# EAGLE design Nano_PCB (EAGLE 9.6.2)
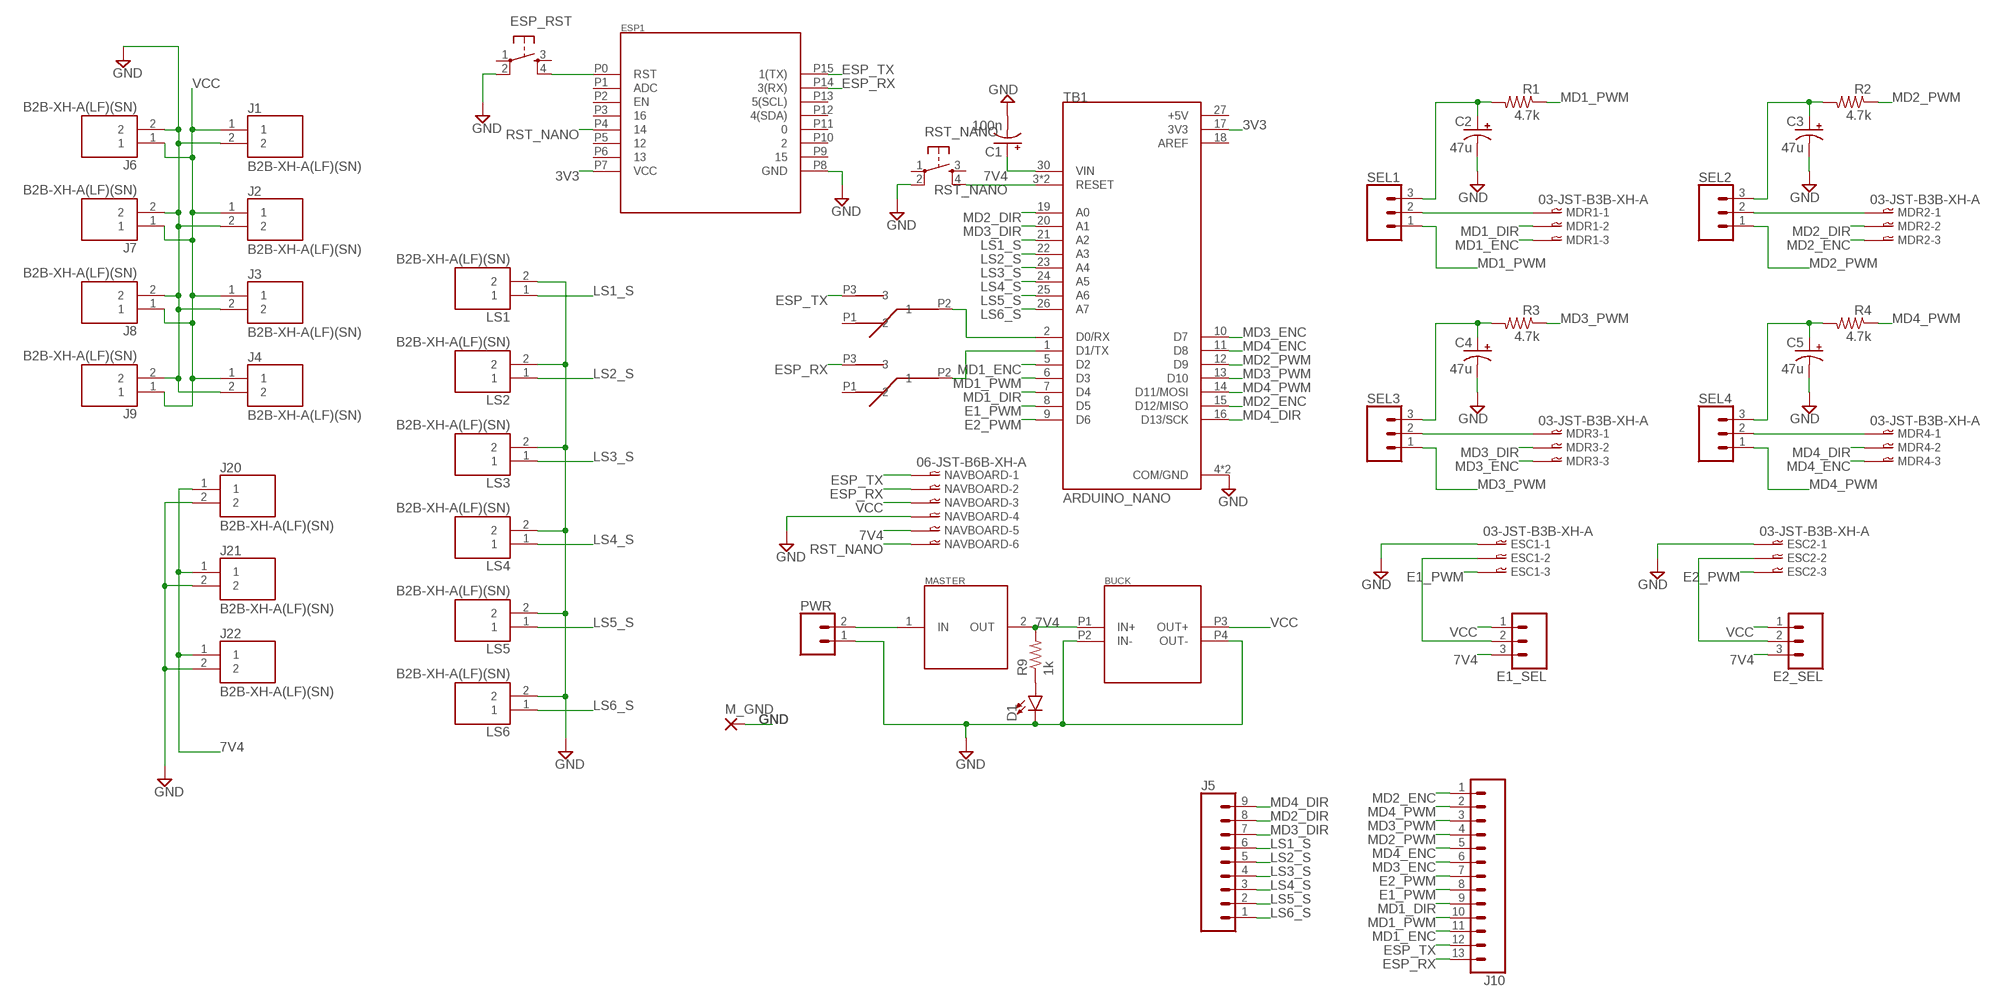
[diagram p0: schematic, sheet 1]

## Parts
BUCK  5V_BUCK  [5V_BUCK]
C1  100n  CPOL-USTT2D6  [TT2D6]
C2  47u  CPOL-USE2-5  [E2-5]
C3  47u  CPOL-USE2-5  [E2-5]
C4  47u  CPOL-USE2-5  [E2-5]
C5  47u  CPOL-USE2-5  [E2-5]
D1  LED3MM  [LED_3MM]
E1_SEL  CONN_03  [1X03]
E2_SEL  CONN_03  [1X03]
ESC1  03-JST-B3B-XH-A  [B3B-XH]
ESC2  03-JST-B3B-XH-A  [B3B-XH]
ESP1  ESP07  [ESP07]
ESP_RST  TAC_SWITCHPTH  [TACTILE-PTH]
J1  B2B-XH-A(LF)(SN)  [JST_B2B-XH-A(LF)(SN)]
J2  B2B-XH-A(LF)(SN)  [JST_B2B-XH-A(LF)(SN)]
J3  B2B-XH-A(LF)(SN)  [JST_B2B-XH-A(LF)(SN)]
J4  B2B-XH-A(LF)(SN)  [JST_B2B-XH-A(LF)(SN)]
J5  CONN_09  [1X09]
J6  B2B-XH-A(LF)(SN)  [JST_B2B-XH-A(LF)(SN)]
J7  B2B-XH-A(LF)(SN)  [JST_B2B-XH-A(LF)(SN)]
J8  B2B-XH-A(LF)(SN)  [JST_B2B-XH-A(LF)(SN)]
J9  B2B-XH-A(LF)(SN)  [JST_B2B-XH-A(LF)(SN)]
J10  CONN_13  [1X13]
J20  B2B-XH-A(LF)(SN)  [JST_B2B-XH-A(LF)(SN)]
J21  B2B-XH-A(LF)(SN)  [JST_B2B-XH-A(LF)(SN)]
J22  B2B-XH-A(LF)(SN)  [JST_B2B-XH-A(LF)(SN)]
LS1  B2B-XH-A(LF)(SN)  [JST_B2B-XH-A(LF)(SN)]
LS2  B2B-XH-A(LF)(SN)  [JST_B2B-XH-A(LF)(SN)]
LS3  B2B-XH-A(LF)(SN)  [JST_B2B-XH-A(LF)(SN)]
LS4  B2B-XH-A(LF)(SN)  [JST_B2B-XH-A(LF)(SN)]
LS5  B2B-XH-A(LF)(SN)  [JST_B2B-XH-A(LF)(SN)]
LS6  B2B-XH-A(LF)(SN)  [JST_B2B-XH-A(LF)(SN)]
M_GND  WIREPADSMD5-2,5  [5-2,5]
MASTER  MED_SWITCH  [MED_SWITCH]
MDR1  03-JST-B3B-XH-A  [B3B-XH]
MDR2  03-JST-B3B-XH-A  [B3B-XH]
MDR3  03-JST-B3B-XH-A  [B3B-XH]
MDR4  03-JST-B3B-XH-A  [B3B-XH]
NAVBOARD  06-JST-B6B-XH-A  [B6B-XH]
PWR  CONN_02PTH4  [1X02_XTRA_BIG]
R1  4.7k  R-US_0204/7  [0204/7]
R2  4.7k  R-US_0204/7  [0204/7]
R3  4.7k  R-US_0204/7  [0204/7]
R4  4.7k  R-US_0204/7  [0204/7]
R9  1k  R-US_0204/7  [0204/7]
RST_NANO  TAC_SWITCHPTH  [TACTILE-PTH]
SEL1  CONN_03  [1X03]
SEL2  CONN_03  [1X03]
SEL3  CONN_03  [1X03]
SEL4  CONN_03  [1X03]
TB1  ARDUINO_NANO  [SHIELD_ARDUINO_NANO]
U$1  SLIDE_SWITCH  [SLIDE_SWITCH]
U$2  SLIDE_SWITCH  [SLIDE_SWITCH]

## Nets
3V3: ESP1.P7(VCC) TB1.17(3V3)
7V4: BUCK.P1(IN+) C1.+ E1_SEL.3 E2_SEL.3 J20.1 J21.1 J22.1 MASTER.2(OUT) NAVBOARD.P$5 R9.2 TB1.30(VIN)
E1_PWM: ESC1.P$3 J10.8 TB1.8(D5)
E2_PWM: ESC2.P$3 J10.7 TB1.9(D6)
ESP_RX: ESP1.P14(3(RX)) J10.13 NAVBOARD.P$2 U$2.P3
ESP_TX: ESP1.P15(1(TX)) J10.12 NAVBOARD.P$1 U$1.P3
GND: BUCK.P2(IN-) BUCK.P4(OUT-) C1.- C2.- C3.- C4.- C5.- D1.K(C) ESC1.P$1 ESC2.P$1 ESP1.P8(GND) ESP_RST.2 J1.2 J2.2 J3.2 J4.2 J6.2 J7.2 J8.2 J9.2 J20.2 J21.2 J22.2 LS1.2 LS2.2 LS3.2 LS4.2 LS5.2 LS6.2 M_GND.1(P) NAVBOARD.P$4 PWR.1 RST_NANO.2 TB1.4(COM/GND) TB1.29(COM/GND)
LS1_S: J5.6 LS1.1 TB1.21(A2)
LS2_S: J5.5 LS2.1 TB1.22(A3)
LS3_S: J5.4 LS3.1 TB1.23(A4)
LS4_S: J5.3 LS4.1 TB1.24(A5)
LS5_S: J5.2 LS5.1 TB1.25(A6)
LS6_S: J5.1 LS6.1 TB1.26(A7)
MD1_DIR: J10.9 MDR1.P$2 TB1.7(D4)
MD1_ENC: J10.11 MDR1.P$3 TB1.5(D2)
MD1_PWM: J10.10 R1.1 SEL1.1 TB1.6(D3)
MD2_DIR: J5.8 MDR2.P$2 TB1.19(A0)
MD2_ENC: J10.1 MDR2.P$3 TB1.15(D12/MISO)
MD2_PWM: J10.4 R2.1 SEL2.1 TB1.12(D9)
MD3_DIR: J5.7 MDR3.P$2 TB1.20(A1)
MD3_ENC: J10.6 MDR3.P$3 TB1.10(D7)
MD3_PWM: J10.3 R3.1 SEL3.1 TB1.13(D10)
MD4_DIR: J5.9 MDR4.P$2 TB1.16(D13/SCK)
MD4_ENC: J10.5 MDR4.P$3 TB1.11(D8)
MD4_PWM: J10.2 R4.1 SEL4.1 TB1.14(D11/MOSI)
N$1: TB1.2(D0/RX) U$1.P2
N$2: C3.+ R2.2 SEL2.3
N$3: TB1.1(D1/TX) U$2.P2
N$4: MDR2.P$1 SEL2.2
N$5: MDR1.P$1 SEL1.2
N$6: C4.+ R3.2 SEL3.3
N$7: MDR3.P$1 SEL3.2
N$8: C5.+ R4.2 SEL4.3
N$9: MDR4.P$1 SEL4.2
N$10: E2_SEL.2 ESC2.P$2
N$11: E1_SEL.2 ESC1.P$2
N$12: D1.A R9.1
N$13: ESP1.P0(RST) ESP_RST.4
N$15: C2.+ R1.2 SEL1.3
N&N: MASTER.1(IN) PWR.2
RST_NANO: ESP1.P4 NAVBOARD.P$6 RST_NANO.4 TB1.3(RESET) TB1.28(RESET)
VCC: BUCK.P3(OUT+) E1_SEL.1 E2_SEL.1 J1.1 J2.1 J3.1 J4.1 J6.1 J7.1 J8.1 J9.1 NAVBOARD.P$3
Unconnected: ESP1.P1(ADC) ESP1.P2(EN) ESP1.P3 ESP1.P5 ESP1.P6 ESP1.P9 ESP1.P10 ESP1.P11 ESP1.P12(4(SDA)) ESP1.P13(5(SCL)) ESP_RST.1 ESP_RST.3 RST_NANO.1 RST_NANO.3 U$1.P1 U$2.P1

## Power pins joined to a net without a drawn wire
+5V: TB1.27(+5V)
AREF: TB1.18(AREF)

## Library data of the parts
BUCK = Robocon:5V_BUCK
C1-C5 = adafruit:CPOL-US: POLARIZED CAPACITOR, American symbol
D1 = SparkFun-LED:LED: LED (Generic) Standard schematic elements and footprints for 5mm, 3mm, 1206, and 0603 sized LEDs. Generic LEDs with no color specified.; PROD_ID: DIO-08794
E1_SEL E2_SEL SEL1-SEL4 = SparkFun-Connectors:CONN_03: Multi connection point. Often used as Generic Header-pin footprint for 0.1 inch spaced/style header connections On any of the 0.1 inch spaced packages, you can populate with these: Break Away Headers - Straight <https://www.sparkfun.com/products/116> (PRT-00116) Break Away Male Headers - Right Angle <https://www.sparkfun.com/products/553> (PRT-00553) Female Headers <https://www.sparkfun.com/products/115> (PRT-00115) Break Away Headers - Machine Pin <https://www.sparkfun.com/products/117> (PRT-00117) Break Away Female Headers - Swiss Machine Pin <https://www.sparkfun.com/products/743> (PRT-00743) Stackable Header - 3 Pin (Female, 0.1") <https://www.sparkfun.com/products/13875> (PRT-13875) For SCREWTERMINALS and SPRING TERMINALS visit here: Screw Terimnals on SparkFun.com <https://www.sparkfun.com/search/results?term=Screw+Terminals> (5mm/3.5mm/2.54mm spacing) This device is also useful as a general connection point to wire up your design to another part of your project. Our various solder wires solder well into these plated through hole pads. Hook-Up Wire - Assortment (Stranded, 22 AWG) <https://www.sparkfun.com/products/11375> (PRT-11375) Hook-Up Wire - Assortment (Solid Core, 22 AWG) <https://www.sparkfun.com/products/11367> (PRT-11367) View the entire wire category on our website here <https://www.sparkfun.com/categories/141> Special notes: Molex polarized connector foot print use with SKU : PRT-08232 with associated crimp pins and housings.
ESC1 ESC2 MDR1-MDR4 = bt_con-jst-xh:03-JST: JST CONNECTOR
ESP1 = Robocon:ESP07
ESP_RST RST_NANO = SparkFun:TAC_SWITCH: Momentary Switch Button commonly used for reset or general input. Spark Fun Electronics SKU : COM-00097
J1-J4 J6-J9 J20-J22 LS1-LS6 = B2B-XH-A_LF__SN_:B2B-XH-A(LF)(SN): Connector Header Through Hole 2 position 0.098" (2.50mm) Check prices <https://pricing.snapeda.com/parts/B2B-XH-A%28LF%29%28SN%29/JST%20Sales/view-part?ref=eda> Check availability <https://pricing.snapeda.com/parts/B2B-XH-A%28LF%29%28SN%29/JST%20Sales/view-part?ref=eda>; AVAILABILITY: In Stock; DESCRIPTION: Connector Header Through Hole 2 position 0.098 (2.50mm); MF: JST Sales; MP: B2B-XH-A(LF)(SN); PACKAGE: None; PRICE: None; PURCHASE-URL: https://pricing.snapeda.com/search/part/B2B-XH-A(LF)(SN)/?ref=eda
J5 = SparkFun-Connectors:CONN_09: Multi connection point. Often used as Generic Header-pin footprint for 0.1 inch spaced/style header connections On any of the 0.1 inch spaced packages, you can populate with these: Break Away Headers - Straight <https://www.sparkfun.com/products/116> (PRT-00116) Break Away Male Headers - Right Angle <https://www.sparkfun.com/products/553> (PRT-00553) Female Headers <https://www.sparkfun.com/products/115> (PRT-00115) Break Away Headers - Machine Pin <https://www.sparkfun.com/products/117> (PRT-00117) Break Away Female Headers - Swiss Machine Pin <https://www.sparkfun.com/products/743> (PRT-00743) For SCREWTERMINALS and SPRING TERMINALS visit here: Screw Terimnals on SparkFun.com <https://www.sparkfun.com/search/results?term=Screw+Terminals> (5mm/3.5mm/2.54mm spacing) This device is also useful as a general connection point to wire up your design to another part of your project. Our various solder wires solder well into these plated through hole pads. Hook-Up Wire - Assortment (Stranded, 22 AWG) <https://www.sparkfun.com/products/11375> (PRT-11375) Hook-Up Wire - Assortment (Solid Core, 22 AWG) <https://www.sparkfun.com/products/11367> (PRT-11367) View the entire wire category on our website here <https://www.sparkfun.com/categories/141> Special notes: Molex polarized connector foot print use with SKU : PRT-08231 with associated crimp pins and housings. 1MM SMD Version SKU: PRT-10208 NOTES ON THE VARIANTS LOCK and LOCK_LONGPADS... This footprint was designed to help hold the alignment of a through-hole component (i.e. 6-pin header) while soldering it into place. You may notice that each hole has been shifted either up or down by 0.005 of an inch from it's more standard position (which is a perfectly straight line). This slight alteration caused the pins (the squares in the middle) to touch the edges of the holes. Because they are alternating, it causes a "brace" to hold the component in place. 0.005 has proven to be the perfect amount of "off-center" position when using our standard breakaway headers. Although looks a little odd when you look at the bare footprint, once you have a header in there, the alteration is very hard to notice. Also,if you push a header all the way into place, it is covered up entirely on the bottom side.
J10 = SparkFun-Connectors:CONN_13: Multi connection point. Often used as Generic Header-pin footprint for 0.1 inch spaced/style header connections On any of the 0.1 inch spaced packages, you can populate with these: Break Away Headers - Straight <https://www.sparkfun.com/products/116> (PRT-00116) Break Away Male Headers - Right Angle <https://www.sparkfun.com/products/553> (PRT-00553) Female Headers <https://www.sparkfun.com/products/115> (PRT-00115) Break Away Headers - Machine Pin <https://www.sparkfun.com/products/117> (PRT-00117) Break Away Female Headers - Swiss Machine Pin <https://www.sparkfun.com/products/743> (PRT-00743) For SCREWTERMINALS and SPRING TERMINALS visit here: Screw Terimnals on SparkFun.com <https://www.sparkfun.com/search/results?term=Screw+Terminals> (5mm/3.5mm/2.54mm spacing) This device is also useful as a general connection point to wire up your design to another part of your project. Our various solder wires solder well into these plated through hole pads. Hook-Up Wire - Assortment (Stranded, 22 AWG) <https://www.sparkfun.com/products/11375> (PRT-11375) Hook-Up Wire - Assortment (Solid Core, 22 AWG) <https://www.sparkfun.com/products/11367> (PRT-11367) View the entire wire category on our website here <https://www.sparkfun.com/categories/141> Special notes: Molex polarized connector foot print use with SKU : PRT-08231 with associated crimp pins and housings. 1MM SMD Version SKU: PRT-10208 NOTES ON THE VARIANTS LOCK and LOCK_LONGPADS... This footprint was designed to help hold the alignment of a through-hole component (i.e. 6-pin header) while soldering it into place. You may notice that each hole has been shifted either up or down by 0.005 of an inch from it's more standard position (which is a perfectly straight line). This slight alteration caused the pins (the squares in the middle) to touch the edges of the holes. Because they are alternating, it causes a "brace" to hold the component in place. 0.005 has proven to be the perfect amount of "off-center" position when using our standard breakaway headers. Although looks a little odd when you look at the bare footprint, once you have a header in there, the alteration is very hard to notice. Also,if you push a header all the way into place, it is covered up entirely on the bottom side.
M_GND = wirepad:WIREPAD: Wire PAD connect wire on PCB
MASTER = Robocon:MED_SWITCH
NAVBOARD = bt_con-jst-xh:06-JST: JST CONNECTOR
PWR = SparkFun-Connectors:CONN_02: Multi connection point. Often used as Generic Header-pin footprint for 0.1 inch spaced/style header connections On any of the 0.1 inch spaced packages, you can populate with these: Break Away Headers - Straight <https://www.sparkfun.com/products/116> (PRT-00116) Break Away Male Headers - Right Angle <https://www.sparkfun.com/products/553> (PRT-00553) Female Headers <https://www.sparkfun.com/products/115> (PRT-00115) Break Away Headers - Machine Pin <https://www.sparkfun.com/products/117> (PRT-00117) Break Away Female Headers - Swiss Machine Pin <https://www.sparkfun.com/products/743> (PRT-00743) For SCREWTERMINALS and SPRING TERMINALS visit here: Screw Terimnals on SparkFun.com <https://www.sparkfun.com/search/results?term=Screw+Terminals> (5mm/3.5mm/2.54mm spacing) This device is also useful as a general connection point to wire up your design to another part of your project. Our various solder wires solder well into these plated through hole pads. Hook-Up Wire - Assortment (Stranded, 22 AWG) <https://www.sparkfun.com/products/11375> (PRT-11375) Hook-Up Wire - Assortment (Solid Core, 22 AWG) <https://www.sparkfun.com/products/11367> (PRT-11367) View the entire wire category on our website here <https://www.sparkfun.com/categories/141> Special notes: Molex polarized connector foot print use with: PRT-08233 with associated crimp pins and housings. 2.54_SCREWTERM for use with PRT-10571. 3.5mm Screw Terminal footprints for PRT-08084 5mm Screw Terminal footprints for use with PRT-08432
R1-R4 R9 = adafruit:R-US_: RESISTOR, American symbol
TB1 = ARDUINO_NANO:ARDUINO_NANO: Arduino Nano, Through Hole Check availability <https://pricing.snapeda.com/parts/Arduino%20Nano/Arduino/view-part?ref=eda>; AVAILABILITY: Not in stock; DESCRIPTION: Small, complete, and breadboard-friendly board based on the ATmega328 (Arduino Nano 3.x); MF: Arduino; MP: Arduino Nano; PACKAGE: Non-Standard Arduino; PRICE: None
U$1 U$2 = Robocon:SLIDE_SWITCH

## Board
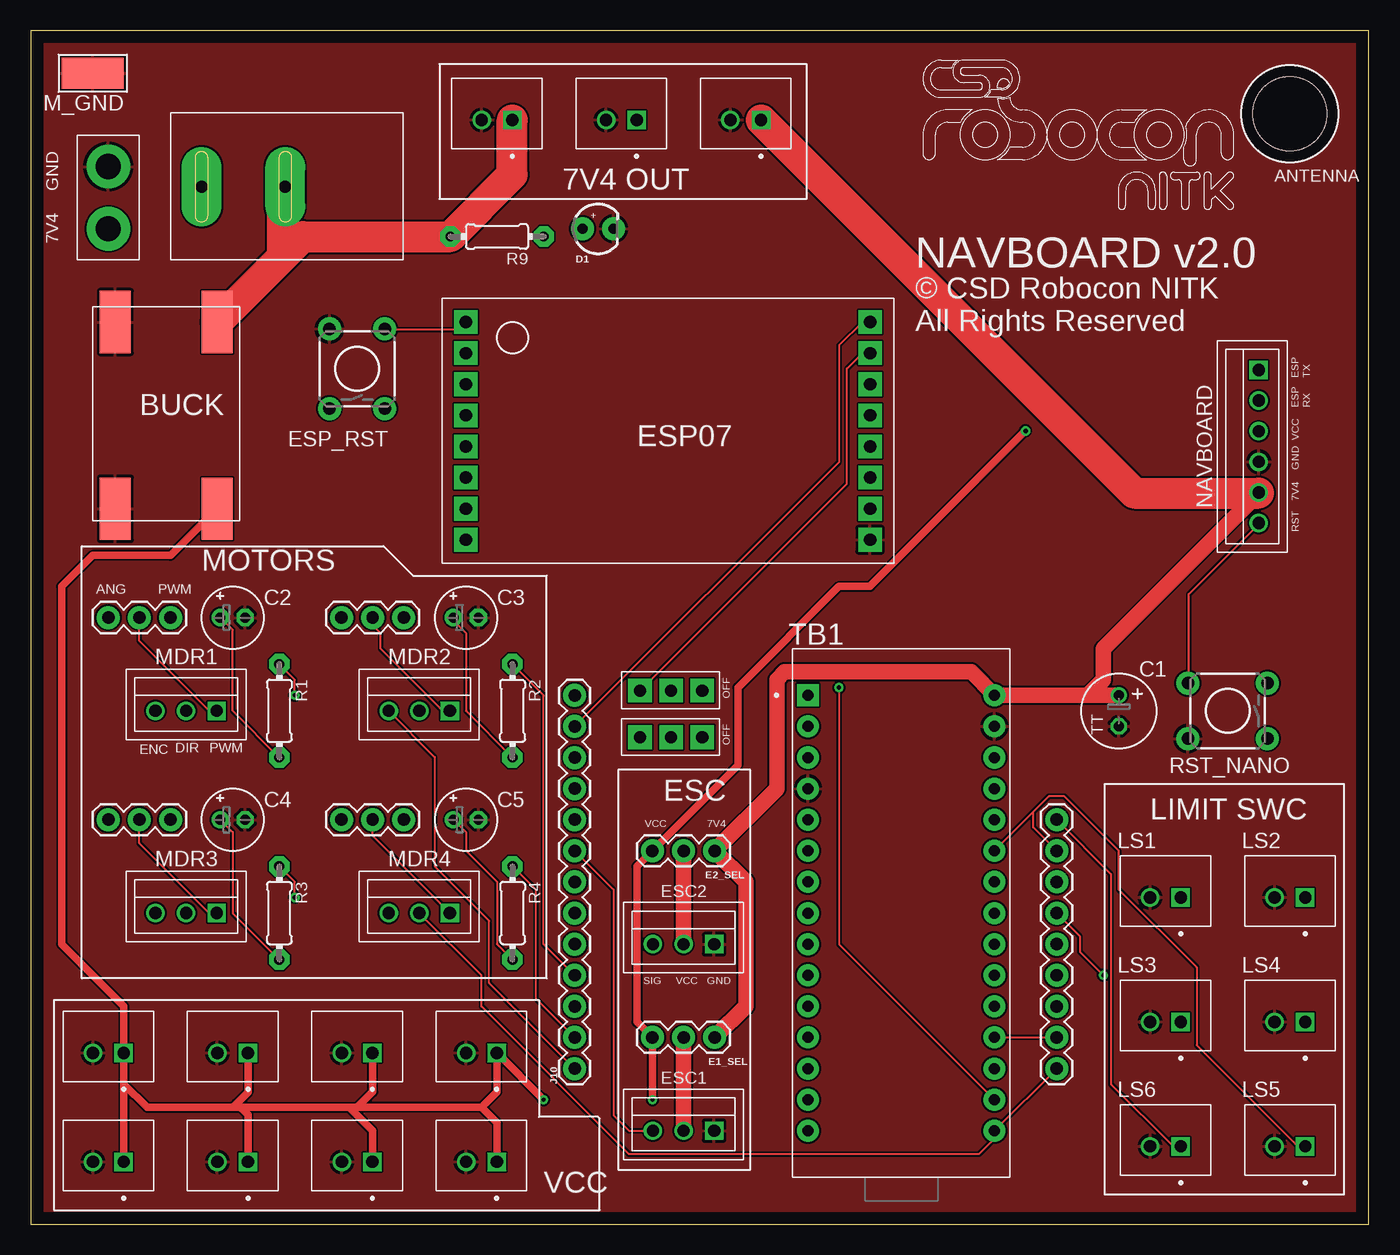
[diagram p1: board, top side]
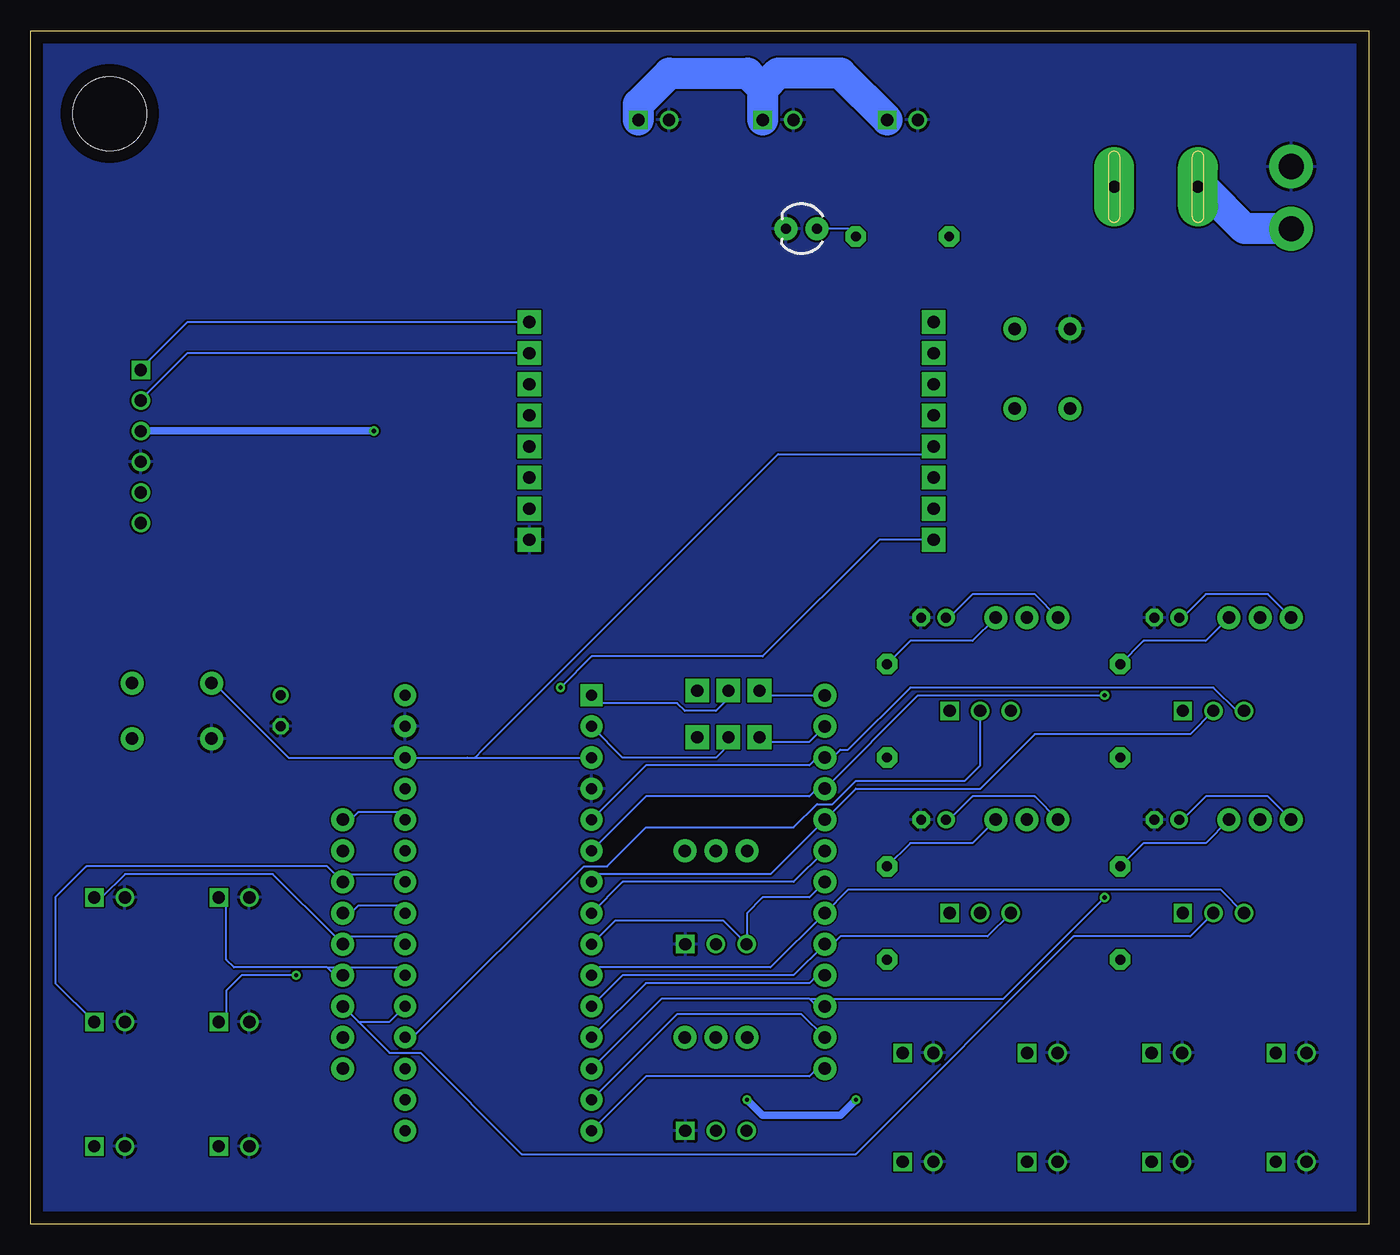
[diagram p2: board, bottom side, seen from below]

Size 109.33 x 97.46 mm. Coordinates in mm from the lower left corner, seen from the top.
Outline: 0,0 109.33,0 109.33,97.46 0,97.46 0,0
Copper layers (1*16): Top 0.035mm / dielectric 1.5mm / Bottom 0.035mm
Design rules "default": minimum track width 6mil, minimum drill 0.35mm, track to track 6mil, track to pad 6mil, pad to pad 6mil, via to via 6mil, smd to smd 6mil, copper to edge 40mil, drill to drill 6mil, minimum pad ring 10mil, minimum via ring 8mil, stop-mask expansion 4mil, vias tented up to drill 0mil, thermal gap 10mil
Holes 6 mm at 102.87,90.68

### Footprints (pad centres in the part's own frame; a part is rotated, then mirrored left to right if it is on the bottom)
5V_BUCK = smd 5.08 x 2.54: P1 1.27,10.16; P2 1.27,1.84; P3 16.51,10.16; P4 16.51,1.84
TT2D6 = drill 0.813: + -1.27,0 | drill 0.813 octagon: - 1.27,0
E2-5 = drill 0.813 pad 1.422: + -1.016,0 | drill 0.813 pad 1.422 octagon: - 1.016,0
LED_3MM = drill 0.813 pad 1.88: A -1.27,0; K 1.27,0
1X03 = drill 1.016 pad 1.88: 1 0,0; 2 2.54,0; 3 5.08,0
B3B-XH = drill 1 square: P$1 2.5,0 | drill 1: P$2 0,0; P$3 -2.5,0
ESP07 = drill 1 pad 1.93 square: P0 -16.51,8.89; P1 -16.51,6.35; P2 -16.51,3.81; P3 -16.51,1.27; P4 -16.51,-1.27; P5 -16.51,-3.81; P6 -16.51,-6.35; P7 -16.51,-8.89; P8 16.51,-8.89; P9 16.51,-6.35; P10 16.51,-3.81; P11 16.51,-1.27; P12 16.51,1.27; P13 16.51,3.81; P14 16.51,6.35; P15 16.51,8.89
TACTILE-PTH = drill 1.016 pad 1.88: 1 -3.251,2.261; 2 3.251,2.261; 3 -3.251,-2.261; 4 3.251,-2.261
JST_B2B-XH-A(LF)(SN) = drill 1 square: 1 1.25,0 | drill 1: 2 -1.25,0
1X09 = drill 1.016 pad 1.88: 1 0,0; 2 2.54,0; 3 5.08,0; 4 7.62,0; 5 10.16,0; 6 12.7,0; 7 15.24,0; 8 17.78,0; 9 20.32,0
1X13 = drill 1.016 pad 1.88: 1 0,0; 2 2.54,0; 3 5.08,0; 4 7.62,0; 5 10.16,0; 6 12.7,0; 7 15.24,0; 8 17.78,0; 9 20.32,0; 10 22.86,0; 11 25.4,0; 12 27.94,0; 13 30.48,0
5-2,5 = smd 2.54 x 5.08: 1 0,0
MED_SWITCH = drill 0.98 pad 3.26 long: 1 2.525,5.969; 2 9.383,5.969
B6B-XH = drill 1 square: P$1 6.25,0 | drill 1: P$2 3.75,0; P$3 1.25,0; P$4 -1.25,0; P$5 -3.75,0; P$6 -6.25,0
1X02_XTRA_BIG = drill 2.057 pad 3.556: 1 -2.54,0; 2 2.54,0
0204/7 = drill 0.813 pad 1.676 octagon: 1 -3.81,0; 2 3.81,0
SHIELD_ARDUINO_NANO = drill 0.9 pad 1.8 square: 1 -7.62,17.78 | drill 0.9 pad 1.8: 2 -7.62,15.24; 3 -7.62,12.7; 4 -7.62,10.16; 5 -7.62,7.62; 6 -7.62,5.08; 7 -7.62,2.54; 8 -7.62,0; 9 -7.62,-2.54; 10 -7.62,-5.08; 11 -7.62,-7.62; 12 -7.62,-10.16; 13 -7.62,-12.7; 14 -7.62,-15.24; 15 -7.62,-17.78; 16 7.62,-17.78; 17 7.62,-15.24; 18 7.62,-12.7; 19 7.62,-10.16; 20 7.62,-7.62; 21 7.62,-5.08; 22 7.62,-2.54; 23 7.62,0; 24 7.62,2.54; 25 7.62,5.08; 26 7.62,7.62; 27 7.62,10.16; 28 7.62,12.7; 29 7.62,15.24; 30 7.62,17.78
SLIDE_SWITCH = drill 1 pad 1.93 square: P1 1.524,6.604; P2 1.524,4.064; P3 1.524,1.524

### Placement (x,y rotation side)
BUCK  5.08,74.93 270 top
C1  88.9,41.91 270 top
C2  16.51,49.53 0 top
C3  35.56,49.53 0 top
C4  16.51,33.02 0 top
C5  35.56,33.02 0 top
D1  46.35,81.28 0 top
E1_SEL  50.8,15.24 0 top
E2_SEL  50.8,30.48 0 top
ESC1  53.34,7.62 0 top
ESC2  53.34,22.86 0 top
ESP1  52.07,64.77 0 top
ESP_RST  26.67,69.85 90 top
J1  6.35,5.08 0 top
J2  16.51,5.08 0 top
J3  26.67,5.08 0 top
J4  36.83,5.08 0 top
J5  83.82,33.02 270 top
J6  6.35,13.97 0 top
J7  16.51,13.97 0 top
J8  26.67,13.97 0 top
J9  36.83,13.97 0 top
J10  44.45,12.7 90 top
J20  38.1,90.17 0 top
J21  48.26,90.17 0 top
J22  58.42,90.17 0 top
LS1  92.71,26.67 0 top
LS2  102.87,26.67 0 top
LS3  92.71,16.51 0 top
LS4  102.87,16.51 0 top
LS5  102.87,6.35 0 top
LS6  92.71,6.35 0 top
M_GND  5.08,93.98 90 top
MASTER  11.43,78.74 0 top
MDR1  12.7,41.91 0 top
MDR2  31.75,41.91 0 top
MDR3  12.7,25.4 0 top
MDR4  31.75,25.4 0 top
NAVBOARD  100.33,63.5 90 top
PWR  6.35,83.82 270 top
R1  20.32,41.91 270 top
R2  39.37,41.91 270 top
R3  20.32,25.4 270 top
R4  39.37,25.4 270 top
R9  38.1,80.64 180 top
RST_NANO  97.79,41.91 180 top
SEL1  11.43,49.53 180 top
SEL2  30.48,49.53 180 top
SEL3  11.43,33.02 180 top
SEL4  30.48,33.02 180 top
TB1  71.12,25.4 0 top
U$1  48.26,41.27 270 top
U$2  48.26,45.09 270 top
U$5  [LOGO]  72.39,82.55 0 top

### Tracks (layer width: path | path; a pad name or v marks a point on that pad's centre or on a via)
3V3  (via drill 0.35)
  Top 0.152: TB1.17 66.04,22.86 v66.04,43.81
  Bottom 0.152: v66.04,43.81 63.5,46.35 49.53,46.35 40.01,55.88 ESP1.P7
7V4
  Top 0.152: BUCK.P1 20.32,78.74 20.32,80.01 | 20.32,80.01 20.32,84.45 20.58,84.59 MASTER.2 | R9.2 20.95,80.64 20.32,80.01 | TB1.30 86.36,43.18 C1.+ | 100.33,59.69 NAVBOARD.P$5
  Top 1.27: C1.+ TB1.30 76.83,45.09 61.59,45.09 60.96,44.45 60.96,35.56 E2_SEL.3 58.42,27.94 58.42,17.78 E1_SEL.3 | 86.36,43.18 87.63,44.45 87.63,46.99 100.33,59.69
  Top 2.54: BUCK.P1 20.58,79 | 20.58,79 20.58,84.59 | 20.58,79 22.23,80.64 R9.2 39.35,85.7 J20.1 | J22.1 90.15,59.69 100.33,59.69
  Bottom 2.54: J21.1 49.51,92.73 | 49.51,92.73 48.26,93.98 43.16,93.98 J20.1 | J22.1 59.67,91.46 57.15,93.98 50.76,93.98 49.51,92.73
E1_PWM
  Top 0.152: J10.8 47.62,27.3 47.62,8.89 48.9,7.62 ESC1.P$3
  Bottom 0.152: TB1.8 60.96,27.94 46.99,27.94 J10.8
E2_PWM
  Bottom 0.152: 50.8,22.86 50.8,25.4 49.53,26.67 45.72,26.67 J10.7 | 50.8,22.86 ESC2.P$3 | TB1.9 61.59,24.77 52.7,24.77 50.8,22.86
ESP_RX
  Top 0.152: ESP1.P14 67.94,71.12 66.67,69.85 66.67,60.45 U$2.P3
  Bottom 0.152: ESP1.P14 96.52,71.12 100.33,67.31 NAVBOARD.P$2 | U$2.P3 49.4,43.18 J10.13
ESP_TX
  Top 0.152: J10.12 66.04,62.23 66.04,71.75 67.94,73.66 ESP1.P15
  Bottom 0.152: J10.12 45.72,39.37 49.4,39.37 U$1.P3 | ESP1.P15 96.52,73.66 100.33,69.85 NAVBOARD.P$1
GND
  pour Top: 0,0 109.22,0 109.22,97.79 -1.27,97.79 -1.27,1.27
  pour Bottom: 0,0 110.49,0 110.49,97.79 -1.27,97.79 -1.27,-1.27
LS1_S
  Bottom 0.152: 85.09,20.95 92.71,20.95 93.34,21.59 93.34,26.67 LS1.1 | 85.09,20.95 84.45,20.32 J5.6 | TB1.21 79.38,20.95 85.09,20.95
LS2_S
  Bottom 0.152: 84.45,23.5 89.53,28.57 101.6,28.57 103.5,26.67 LS2.1 | TB1.22 79.38,23.5 84.45,23.5 | 84.45,23.5 J5.5
LS3_S  (via drill 0.35)
  Top 0.152: v87.63,20.32 85.72,22.23 85.72,23.5 J5.4
  Bottom 0.152: LS3.1 93.34,16.51 93.34,19.05 92.08,20.32 v87.63,20.32 | TB1.23 79.38,26.04 82.55,26.04 83.19,25.4 J5.4
LS4_S
  Bottom 0.152: 84.45,28.57 85.09,29.21 104.78,29.21 107.31,26.67 107.31,19.68 104.14,16.51 LS4.1 | TB1.24 79.38,28.57 84.45,28.57 | 84.45,28.57 J5.3
LS5_S
  Top 0.152: 81.92,33.66 81.92,32.38 J5.2 | LS5.1 103.5,6.35 95.25,14.61 95.25,20.95 88.9,27.3 88.9,30.48 84.45,34.92 83.19,34.92 81.92,33.66 | 81.92,33.66 TB1.25
LS6_S
  Top 0.152: J5.1 88.27,28.57 88.27,11.43 93.34,6.35 LS6.1
  Bottom 0.152: TB1.26 79.38,33.66 82.55,33.66 83.19,33.02 J5.1
MD1_DIR
  Bottom 0.152: TB1.7 62.87,28.57 48.9,28.57 J10.9 41.91,35.56 31.75,35.56 27.3,40.01 14.61,40.01 MDR1.P$2
MD1_ENC
  Bottom 0.152: MDR1.P$3 10.79,41.91 12.7,43.81 37.47,43.81 42.55,38.73 43.18,38.73 43.81,38.1 J10.11 45.09,38.1 45.72,37.47 59.05,37.47 TB1.5
MD1_PWM  (via drill 0.35)
  Top 0.152: R1.1 21.59,44.45 v21.59,43.18
  Bottom 0.152: R1.1 18.41,47.62 13.34,47.62 SEL1.1 | TB1.6 59.05,34.92 45.72,34.92 45.09,35.56 J10.10 36.83,43.18 v21.59,43.18
MD2_DIR
  Top 0.152: TB1.19 J5.8
  Bottom 0.152: TB1.19 78.11,15.24 64.14,29.21 62.23,29.21 59.05,32.38 46.99,32.38 45.09,34.29 43.81,34.29 41.91,36.2 33.02,36.2 31.75,37.47 MDR2.P$2
MD2_ENC
  Top 0.152: J10.1 37.47,19.68 37.47,24.77 33.02,29.21 33.02,38.14 MDR2.P$3
  Bottom 0.152: TB1.15 59.05,12.06 45.72,12.06 45.09,12.7 J10.1
MD2_PWM
  Top 0.152: R2.1 41.91,43.18 41.91,22.86 J10.4
  Bottom 0.152: R2.1 37.47,47.62 32.38,47.62 SEL2.1 | TB1.12 59.05,19.68 45.72,19.68 45.09,20.32 J10.4
MD3_DIR
  Bottom 0.152: TB1.20 80.01,16.51 82.55,16.51 | 82.55,16.51 80.01,13.97 77.47,13.97 69.22,5.71 41.91,5.71 24.13,23.5 14.61,23.5 MDR3.P$2 | 82.55,16.51 J5.7
MD3_ENC
  Bottom 0.152: TB1.10 62.87,20.95 48.9,20.95 J10.6 42.55,27.3 12.11,27.3 MDR3.P$3
MD3_PWM  (via drill 0.35)
  Top 0.152: R3.1 21.59,27.94 v21.59,26.67
  Bottom 0.152: R3.1 18.41,31.11 13.34,31.11 SEL3.1 | TB1.13 57.78,18.41 45.72,18.41 | 45.72,18.41 45.09,17.78 J10.3 | v21.59,26.67 29.84,18.41 45.72,18.41
MD4_DIR
  Top 0.152: MDR4.P$2 36.83,20.32 36.83,17.78 48.9,5.71 77.47,5.71 78.11,6.35 78.74,6.99 TB1.16 J5.9
MD4_ENC
  Bottom 0.152: TB1.11 60.96,20.32 46.99,20.32 J10.5 43.81,22.86 43.18,23.5 31.16,23.5 MDR4.P$3
MD4_PWM
  Top 0.152: R4.1 41.27,27.3 41.27,18.41 J10.2
  Bottom 0.152: R4.1 37.47,31.11 32.38,31.11 SEL4.1 | TB1.14 56.52,17.14 46.35,17.14 J10.2
N$1
  Bottom 0.152: TB1.2 60.96,38.1 53.34,38.1 52.07,39.37 U$1.P2
N$2
  Top 0.152: R2.2 35.56,41.91 35.56,48.26 34.92,48.9 34.92,49.53 C3.+
  Bottom 0.152: SEL2.3 27.3,51.44 32.38,51.44 34.29,49.53 C3.+
N$3
  Bottom 0.152: TB1.1 62.87,42.55 56.52,42.55 55.88,41.91 53.34,41.91 52.07,43.18 U$2.P2
N$4
  Top 0.152: SEL2.2 27.94,48.9 28.57,48.26 28.57,46.99 33.66,41.91 MDR2.P$1
N$5
  Top 0.152: SEL1.2 8.89,47.62 14.61,41.91 MDR1.P$1
N$6
  Top 0.152: R3.2 16.51,25.4 16.51,32 C4.+
  Bottom 0.152: SEL3.3 8.26,34.92 13.34,34.92 15.24,33.02 C4.+
N$7
  Top 0.152: SEL3.2 8.89,31.11 14.61,25.4 MDR3.P$1
N$8
  Top 0.152: R4.2 38.1,22.86 38.1,27.94 35.56,30.48 35.56,32 C5.+
  Bottom 0.152: SEL4.3 27.3,34.92 32.38,34.92 34.29,33.02 C5.+
N$9
  Top 0.152: SEL4.2 27.94,31.71 MDR4.P$1
N$10
  Top 1.27: E2_SEL.2 ESC2.P$2
N$11
  Top 1.27: E1_SEL.2 ESC1.P$2
N$12
  Bottom 0.152: R9.1 42.55,81.28 D1.A
N$13
  Top 0.152: ESP1.P0 35.56,73.03 29.21,73.03 ESP_RST.4
N$15
  Top 0.152: R1.2 16.51,41.91 16.51,48.51 C2.+
  Bottom 0.152: SEL1.3 8.26,51.44 13.34,51.44 15.24,49.53 C2.+
N&N
  Bottom 0.152: 13.34,84.45 MASTER.1
  Bottom 2.54: PWR.2 10.16,81.28 13.34,84.45
RST_NANO
  Top 0.152: NAVBOARD.P$6 100.33,57.15 94.61,51.44 94.61,44.45 RST_NANO.4
  Bottom 0.152: ESP1.P4 36.2,62.87 48.26,62.87 72.39,38.73 73.03,38.1 | RST_NANO.4 93.98,43.81 88.27,38.1 TB1.28 73.66,38.1 73.03,38.1 | 73.03,38.1 TB1.3
VCC  (via drill 0.35)
  Top 0.152: 38.1,5.08 J4.1 | 27.94,13.97 J8.1 | 7.62,11.43 7.62,13.97 J6.1 7.62,13.99 7.62,17.78 | 7.62,5.08 J1.1 | J2.1 17.78,5.08 17.78,6.35 17.78,7.62 17.78,8.89 17.14,9.53 | 17.14,9.53 16.51,9.53 | 17.14,9.53 26.04,9.53
  Top 0.61: BUCK.P3 11.43,54.61 5.08,54.61 2.54,52.07 2.54,22.86 7.62,17.78 7.62,11.43 | 7.62,11.43 7.62,5.08 | 7.62,11.43 9.53,9.53 16.51,9.53 | 16.51,9.53 26.04,9.53 | 26.04,9.53 26.67,9.53 | J7.1 17.76,10.78 16.83,9.84 | 16.51,9.53 16.83,9.84 | J2.1 17.76,8.91 16.83,9.84 | 36.83,9.53 26.67,9.53 | 36.83,9.53 38.1,10.79 38.1,13.97 | 36.83,9.53 38.1,8.26 38.1,5.08 | 27.94,13.97 27.94,10.79 26.67,9.53 | J3.1 27.92,7.64 26.04,9.53 | J9.1 38.1,13.97 | 38.1,13.97 v41.91,10.16 | v50.8,10.16 E1_SEL.1 49.53,16.51 49.53,29.21 E2_SEL.1 57.78,37.47 57.78,43.81 66.04,52.07 68.58,52.07 v81.28,64.77
  Bottom 0.152: 100.33,64.77 NAVBOARD.P$3
  Bottom 0.61: v50.8,10.16 49.53,8.89 43.18,8.89 v41.91,10.16 | v81.28,64.77 100.33,64.77

### Text on the board
tPlace: ESP / TX | ESP / RX | VCC | GND | 7V4 | RST | OFF | OFF
tNames: GND | ANTENNA | 7V4 OUT | 7V4 | + | NAVBOARD v2.0 | © CSD Robocon NITK / All Rights Reserved | BUCK | ESP07 | MOTORS | ANG | PWM | ENC | DIR | PWM | ESC | LIMIT SWC | VCC | 7V4 | SIG | VCC | GND | VCC